# Altium schematic sheet 06_SENSORS_old.SchDoc
size A
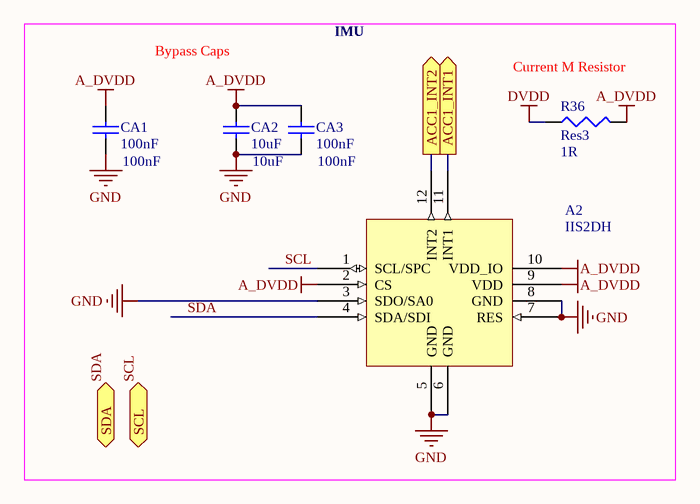
[diagram p0: 06_SENSORS_old.SchDoc]

## Parts
A2  IIS2DH  [*LGA12R50P4X4_200X200X86]
CA1  100nF  [0402]
CA2  10uF  [0402]
CA3  100nF  [0402]
R36  Res3  value 1R  [0402]

## Blocks framed on the sheet
IMU: A2 CA1-CA3 R36

## Ports
ACC1_INT1 (out), ACC1_INT2 (out), SCL (bidir), SDA (bidir)

## Nets
A_DVDD: A2.2(CS) A2.9(VDD) A2.10(VDD_IO) CA1.2 CA2.2 CA3.2 R36.2
DVDD: R36.1
GND: A2.3(SDO/SA0) A2.5(GND) A2.6(GND) A2.7(RES) A2.8(GND) CA1.1 CA2.1 CA3.1
ACC1_INT1: A2.11(INT1) ; port ACC1_INT1
ACC1_INT2: A2.12(INT2) ; port ACC1_INT2
SCL: A2.1(SCL/SPC) ; port SCL
SDA: A2.4(SDA/SDI) ; port SDA

## Notes on the sheet
- Bypass Caps
- (near R36) Current M Resistor

## Library data of the parts
CA1-CA3 = Cap Semi: Capacitor (Semiconductor SIM Model); Published: 8-Jun-2000; LatestRevisionDate: 29-May-2009; LatestRevisionNote: IPC-7351 Footprint Added.; PackageReference: C1206; Publisher: Altium Limited; PackageDescription: Chip Capacitor
  CA1 CA3: Value: 100nF
  CA2: Value: 10uF
R36 = Res3: Resistor; Published: 8-Jun-2000; LatestRevisionDate: 29-May-2009; LatestRevisionNote: IPC-7351 Footprint Added.; PackageReference: J1-0603; Publisher: Altium Limited; PackageDescription: Chip Resistor